# EAGLE schematic MKA DAC Test Board Schematic (EAGLE 9.6.2)

## Sheet 1 of 8
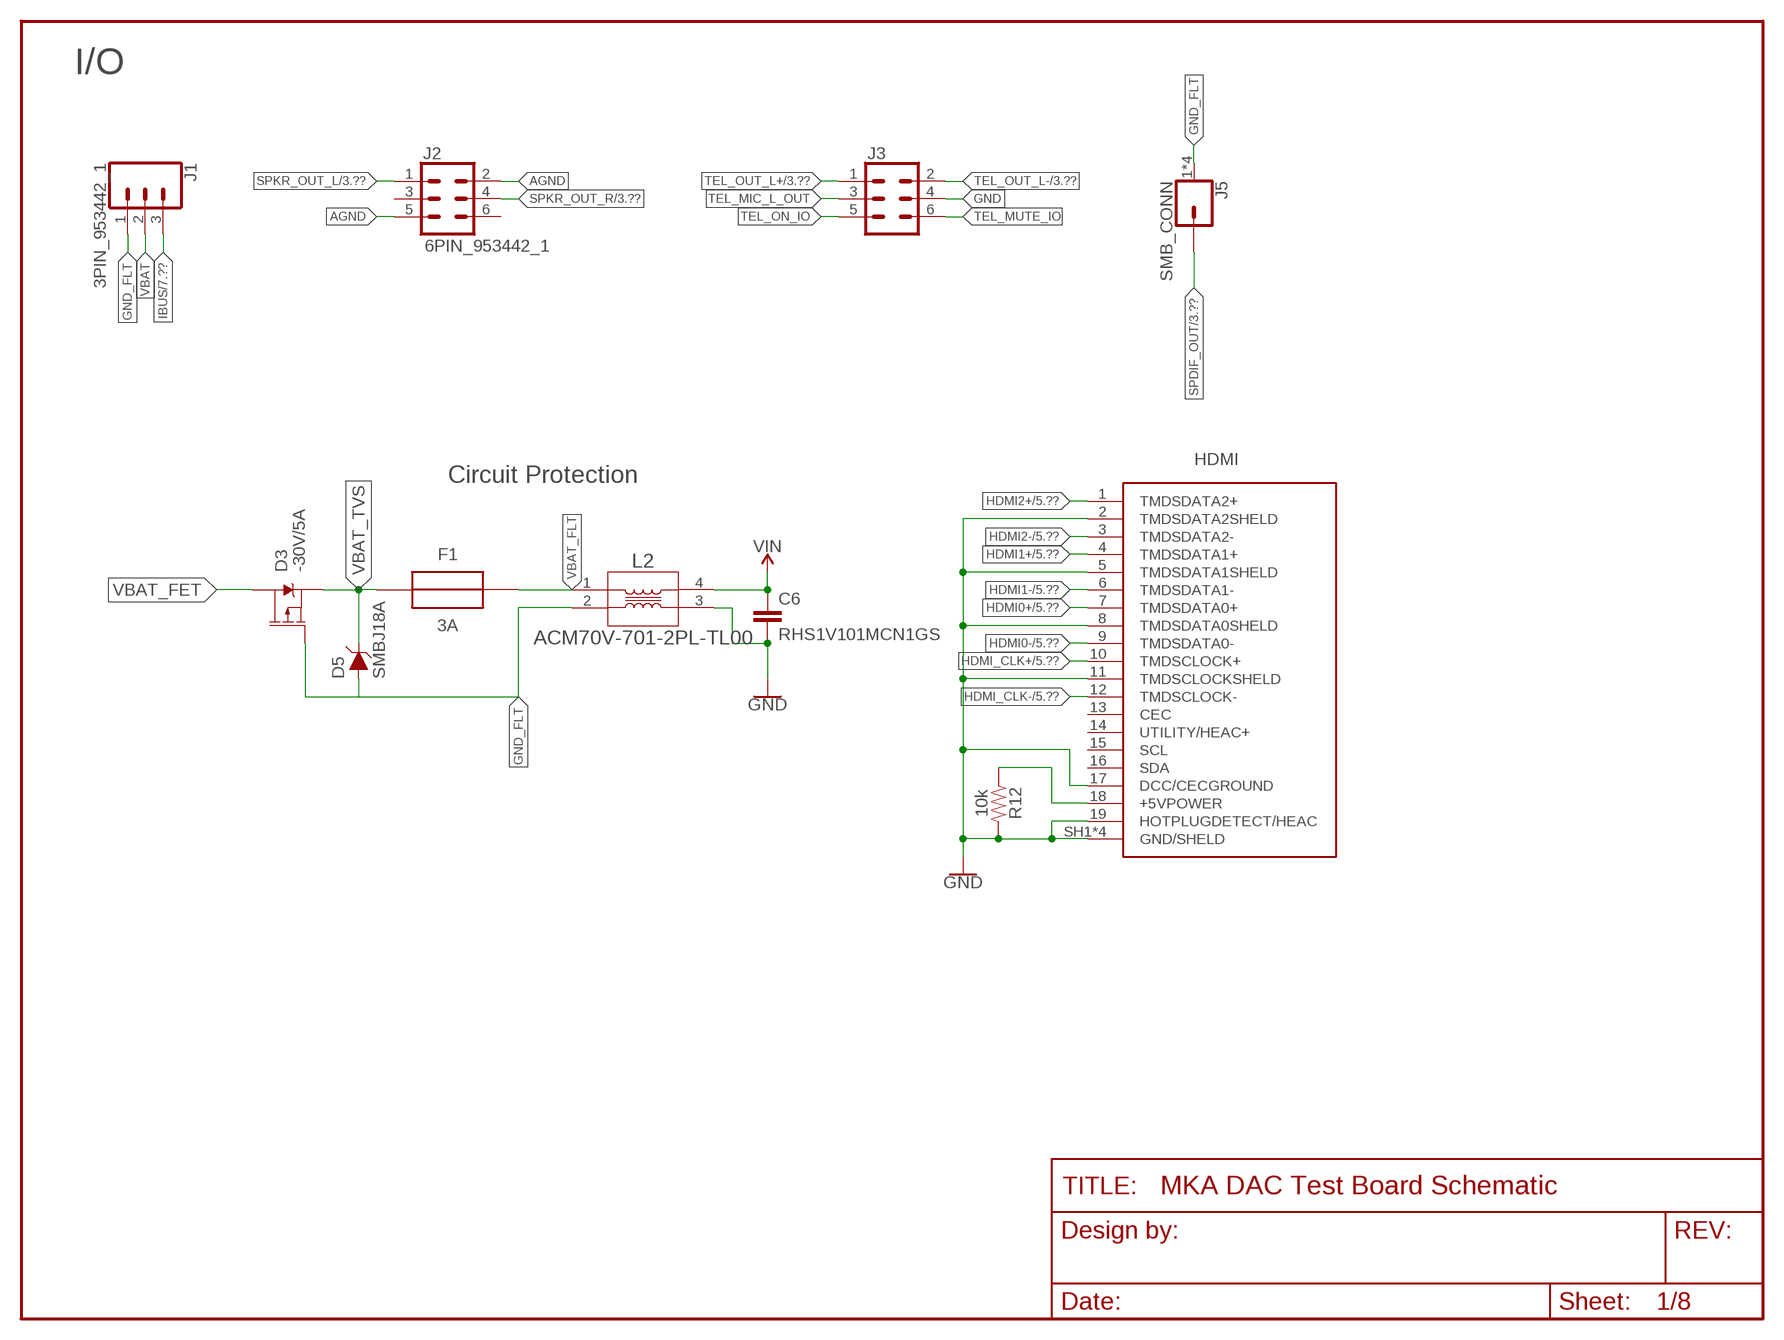
[diagram p0: schematic, sheet 1]

### Parts
C6  RHS1V101MCN1GS  [RHS1V101MCN1GS]
D3  -30V/5A  PMOSFET-SI2347DS  [SOT-23]
D5  SMBJ18A  [DO-214AA]
F1  3A  LITTLEBLOCK_FUSE_3A  [LITTLEFUSE]
FRAME3  FRAME-LETTER  [DUMMY]
J1  3PIN_953442_1  [TE_MQS_3PIN]
J2  6PIN_953442_1  [TE_MQS_6PIN]
J3  6PIN_5_103166_1  [TE_AMPMODU_6_PIN]
J5  SMB_CONN  [MOLEX_SMB]
L2  ACM70V-701-2PL-TL00  [ACM70V-701-2PL-TL00]
R12  10k  10KOHM0603  [0603]
U$2  HDMI_MOLEX_2086581051  [HDMI_MOLEX_2086581051]

### Nets
AGND: J2.2 J2.5 ; also sheet 3,6
GND: C6.2 J3.4 L2.3 R12.2 U$2.2(TMDSDATA2SHELD) U$2.5(TMDSDATA1SHELD) U$2.8(TMDSDATA0SHELD) U$2.11(TMDSCLOCKSHELD) U$2.17(DCC/CECGROUND) U$2.19(HOTPLUGDETECT/HEAC) U$2.SH1(GND/SHELD) U$2.SH2(GND/SHELD) U$2.SH3(GND/SHELD) U$2.SH4(GND/SHELD) ; also sheet 3,4,5,6,7
GND_FLT: D3.1(G) D5.A J1.1 J5.1(GND) J5.2(GND) J5.3(GND) J5.4(GND) L2.2
HDMI0+: U$2.7(TMDSDATA0+) ; also sheet 5
HDMI0-: U$2.9(TMDSDATA0-) ; also sheet 5
HDMI1+: U$2.4(TMDSDATA1+) ; also sheet 5
HDMI1-: U$2.6(TMDSDATA1-) ; also sheet 5
HDMI2+: U$2.1(TMDSDATA2+) ; also sheet 5
HDMI2-: U$2.3(TMDSDATA2-) ; also sheet 5
HDMI_CLK+: U$2.10(TMDSCLOCK+) ; also sheet 5
HDMI_CLK-: U$2.12(TMDSCLOCK-) ; also sheet 5
IBUS [Data]: J1.3 ; also sheet 7
N$16: R12.1 U$2.18(+5VPOWER)
SPDIF_OUT: J5.P$1 ; also sheet 3
SPKR_OUT_L: J2.1 ; also sheet 3
SPKR_OUT_R: J2.4 ; also sheet 3
TEL_MIC_L_OUT: J3.3
TEL_MUTE_IO: J3.6
TEL_ON_IO: J3.5
TEL_OUT_L+: J3.1 ; also sheet 3
TEL_OUT_L-: J3.2 ; also sheet 3
VBAT: J1.2
VBAT_FET: D3.3(D)
VBAT_FLT: F1.OUT(IN) L2.1
VBAT_TVS: D3.2(S) D5.C F1.IN(OUT)
VCC: C6.1 L2.4 ; supply symbol labelled VIN ; also sheet 4
Unconnected: J2.3 J2.6 U$2.13(CEC) U$2.14(UTILITY/HEAC+) U$2.15(SCL) U$2.16(SDA)

### Notes on the sheet
- I/O
- Circuit Protection

## Sheet 2 of 8
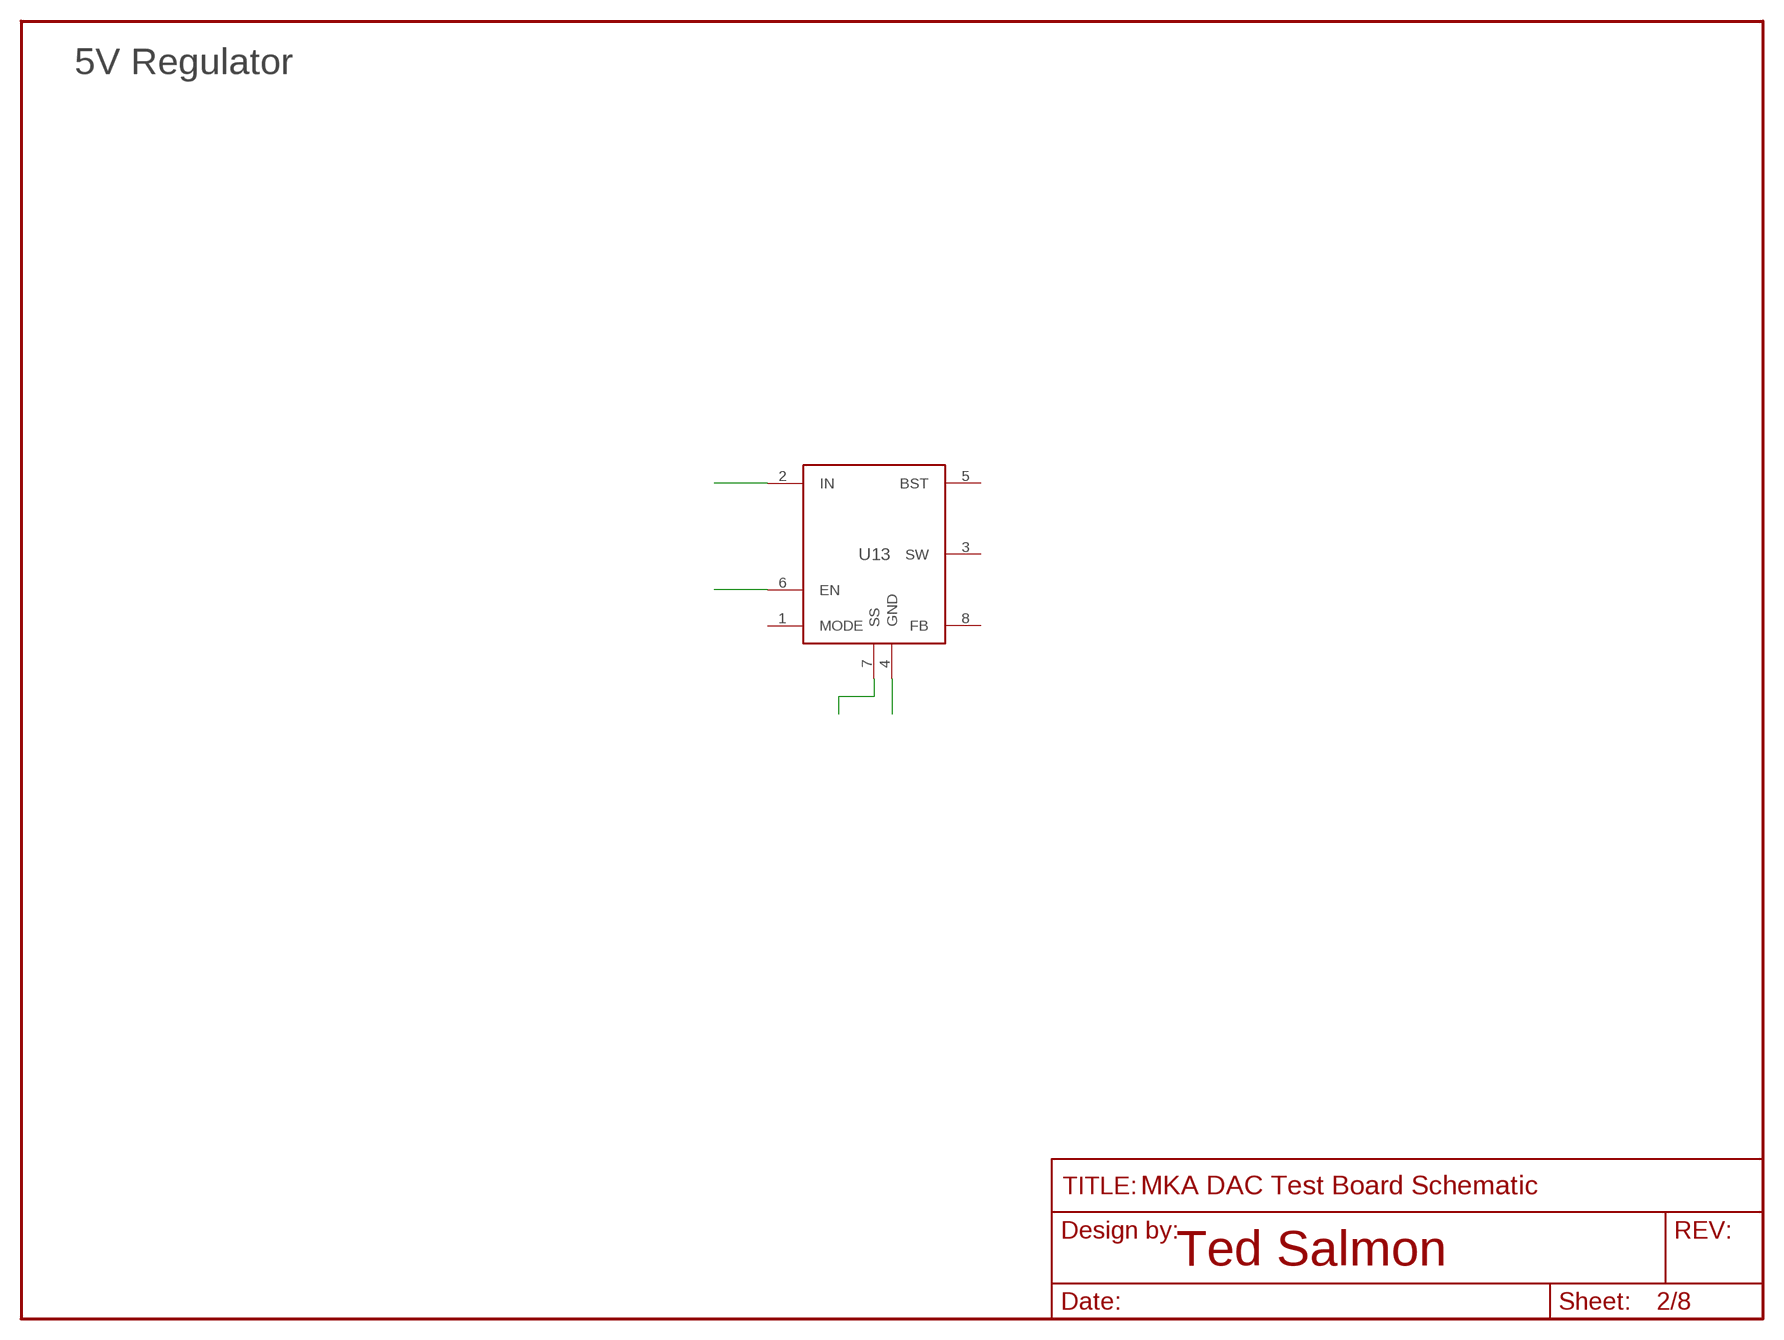
[diagram p1: schematic, sheet 2]

### Parts
FRAME1  FRAME-LETTER  [DUMMY]
U13  MP2348  [SOT583]

### Nets
N$1: U13.2(IN)
N$3: U13.6(EN)
N$4: U13.4(GND)
N$7: U13.7(SS)
Unconnected: U13.1(MODE) U13.3(SW) U13.5(BST) U13.8(FB)

### Notes on the sheet
- 5V Regulator
- Ted Salmon

## Sheet 3 of 8
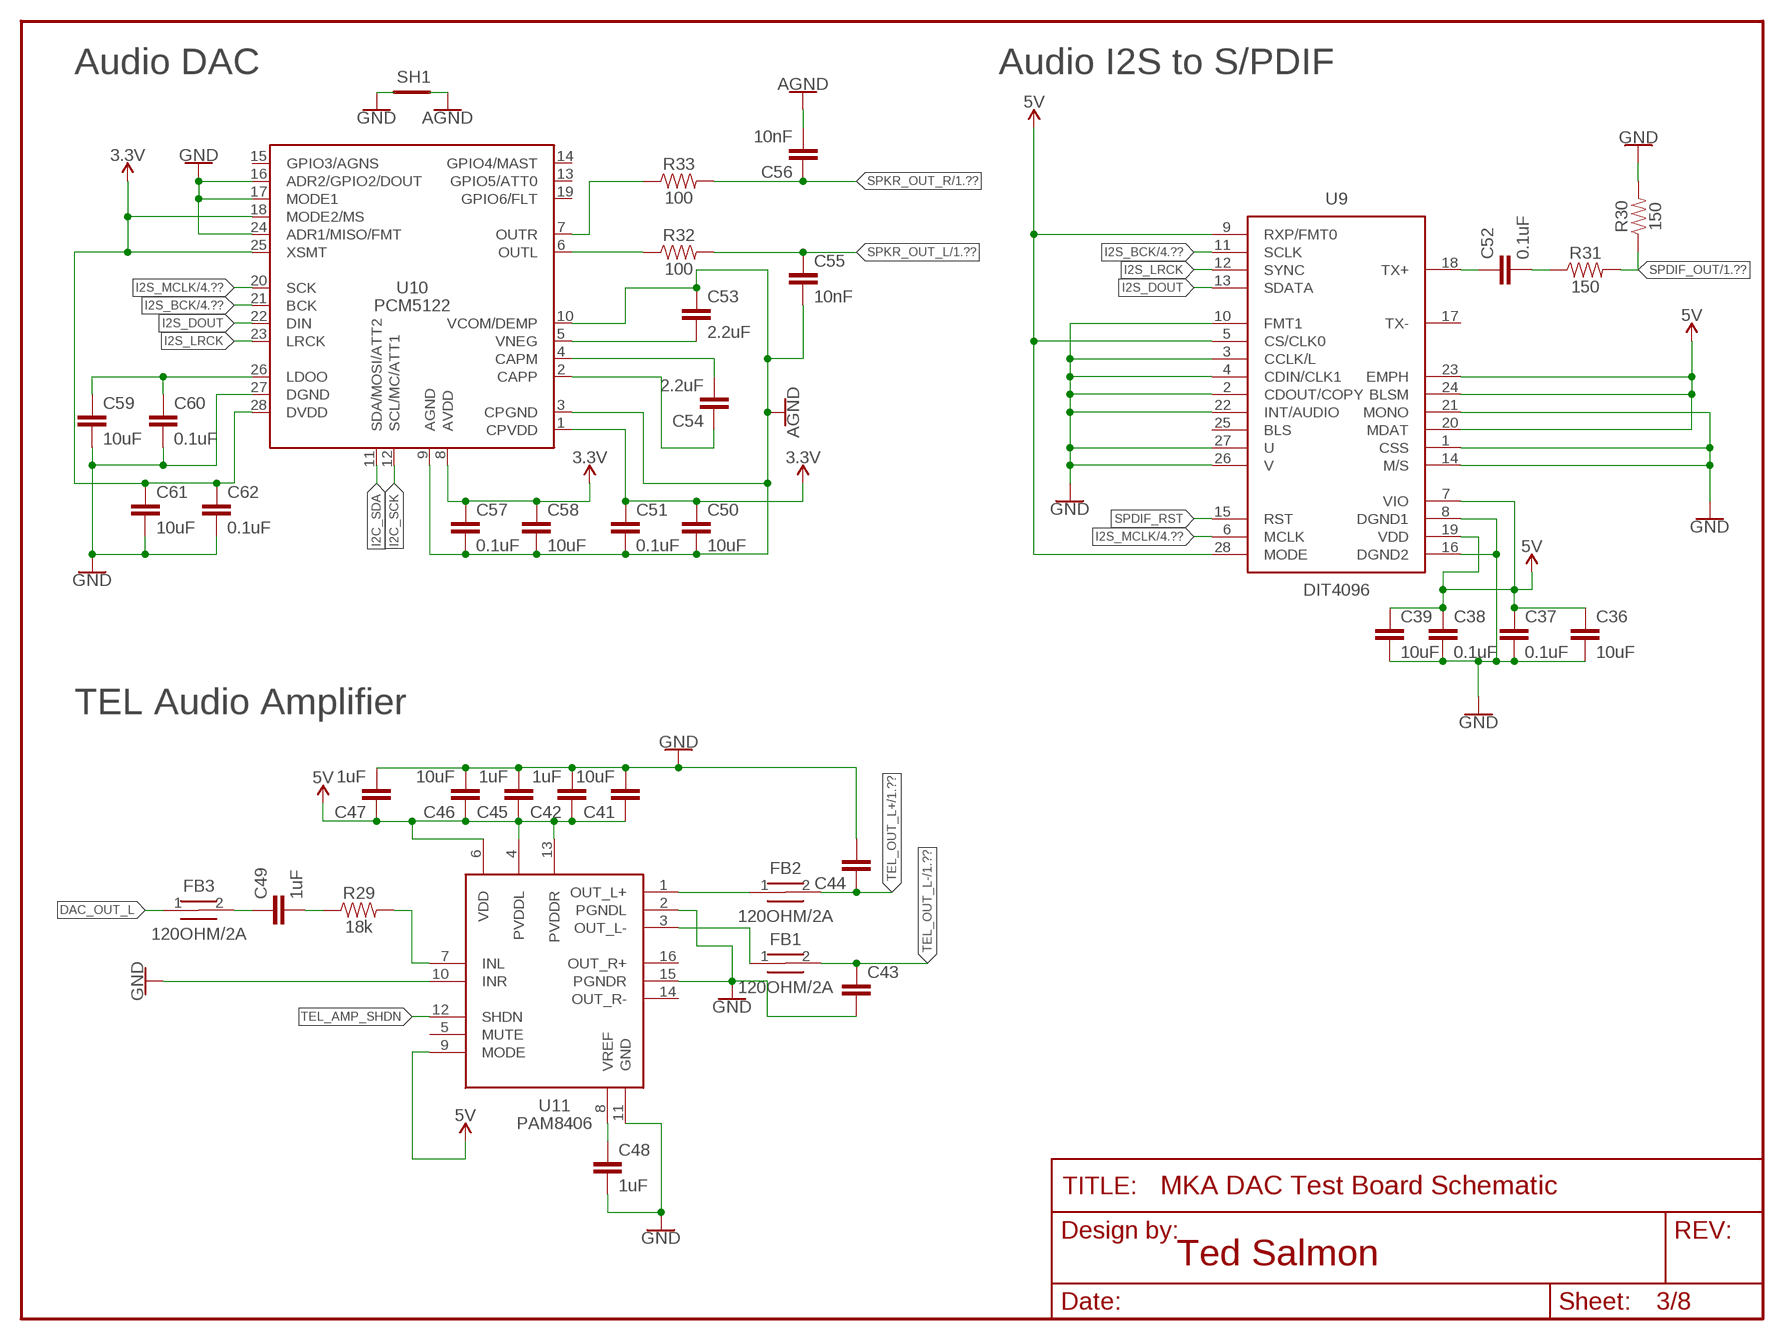
[diagram p2: schematic, sheet 3]

### Parts
C36  10uF  10UF0603  [0603]
C37  0.1uF  0.1UF0603  [0603]
C38  0.1uF  0.1UF0603  [0603]
C39  10uF  10UF0603  [0603]
C41  10uF  10UF0603  [0603]
C42  1uF  1UF0603  [0603]
C43  200pF  220PF0603  [0603]
C44  200pF  220PF0603  [0603]
C45  1uF  1UF0603  [0603]
C46  10uF  10UF0603  [0603]
C47  1uF  1UF0603  [0603]
C48  1uF  1UF0603  [0603]
C49  1uF  1UF0603  [0603]
C50  10uF  10UF0603  [0603]
C51  0.1uF  0.1UF0603  [0603]
C52  0.1uF  0.1UF0603  [0603]
C53  2.2uF  2.2UF0603  [0603]
C54  2.2uF  2.2UF0603  [0603]
C55  10nF  10NF0603  [0603]
C56  10nF  10NF0603  [0603]
C57  0.1uF  0.1UF0603  [0603]
C58  10uF  10UF0603  [0603]
C59  10uF  10UF0603  [0603]
C60  0.1uF  0.1UF0603  [0603]
C61  10uF  10UF0603  [0603]
C62  0.1uF  0.1UF0603  [0603]
FB1  120OHM/2A  FERRITE_2A/120OHM0603  [0603]
FB2  120OHM/2A  FERRITE_2A/120OHM0603  [0603]
FB3  120OHM/2A  FERRITE_2A/120OHM0603  [0603]
FRAME2  FRAME-LETTER  [DUMMY]
R29  18k  18KOHM0603  [0603]
R30  150  150OHM0603  [0603]
R31  150  150OHM0603  [0603]
R32  100  100OHM0603  [0603]
R33  100  100OHM0603  [0603]
SH1  SHORTT5  [SHORT_TOP-50]
U9  DIT4096  [TSSOP28]
U10  PCM5122  [TSSOP28]
U11  PAM8406  [SOP-16]

### Nets
3.3V [3.3V]: C50.1 C51.1 C57.1 C58.1 C61.1 C62.1 U10.1(CPVDD) U10.8(AVDD) U10.18(MODE2/MS) U10.25(XSMT) U10.28(DVDD) ; also sheet 4,6
5V [USB_5V]: C36.1 C37.1 C38.1 C39.1 C41.1 C42.1 C45.1 C46.1 C47.1 U9.5(CS/CLK0) U9.7(VIO) U9.9(RXP/FMT0) U9.19(VDD) U9.20(MDAT) U9.23(EMPH) U9.24(BLSM) U9.28(MODE) U11.4(PVDDL) U11.6(VDD) U11.9(MODE) U11.13(PVDDR)
AGND: C50.2 C51.2 C53.1 C55.2 C56.2 C57.2 C58.2 SH1.2 U10.3(CPGND) U10.9(AGND) U10.10(VCOM/DEMP) ; also sheet 1,6
DAC_CAPM: C54.2 U10.4(CAPM)
DAC_CAPP: C54.1 U10.2(CAPP)
DAC_LDOO: C59.1 C60.1 U10.26(LDOO)
DAC_OUT_L: FB3.1
DAC_OUT_L1: R32.1 U10.6(OUTL)
DAC_OUT_R: R33.1 U10.7(OUTR)
DAC_VNEG: C53.2 U10.5(VNEG)
GND: C36.2 C37.2 C38.2 C39.2 C41.2 C42.2 C43.2 C44.2 C45.2 C46.2 C47.2 C48.2 C59.2 C60.2 C61.2 C62.2 R30.2 SH1.1 U9.1(CSS) U9.2(CDOUT/COPY) U9.3(CCLK/L) U9.4(CDIN/CLK1) U9.8(DGND1) U9.10(FMT1) U9.14(M/S) U9.16(DGND2) U9.21(MONO) U9.22(INT/AUDIO) U9.26(V) U9.27(U) U10.16(ADR2/GPIO2/DOUT) U10.17(MODE1) U10.24(ADR1/MISO/FMT) U10.27(DGND) U11.2(PGNDL) U11.10(INR) U11.11(GND) U11.15(PGNDR) ; also sheet 1,4,5,6,7
I2C_SCK [MCU_Data]: U10.12(SCL/MC/ATT1)
I2C_SDA [MCU_Data]: U10.11(SDA/MOSI/ATT2)
I2S_BCK: U9.11(SCLK) U10.21(BCK) ; also sheet 4
I2S_DOUT: U9.13(SDATA) U10.22(DIN)
I2S_LRCK: U9.12(SYNC) U10.23(LRCK)
I2S_MCLK: U9.6(MCLK) U10.20(SCK) ; also sheet 4
SPDIF_OUT: R30.1 R31.2 ; also sheet 1
SPDIF_RST: U9.15(RST)
SPDIF_TX_FLT: C52.1 U9.18(TX+)
SPDIF_TX_RES: C52.2 R31.1
SPKR_OUT_L: C55.1 R32.2 ; also sheet 1
SPKR_OUT_R: C56.1 R33.2 ; also sheet 1
TEL_AMP_IN: C49.1 FB3.2
TEL_AMP_INL: R29.2 U11.7(INL)
TEL_AMP_INL_CAP_RES: C49.2 R29.1
TEL_AMP_OUT_L+: FB2.1 U11.1(OUT_L+)
TEL_AMP_OUT_L-: FB1.1 U11.3(OUT_L-)
TEL_AMP_SHDN [MCU_Data]: U11.12(SHDN)
TEL_AMP_VREF: C48.1 U11.8(VREF)
TEL_OUT_L+: C44.1 FB2.2 ; also sheet 1
TEL_OUT_L-: C43.1 FB1.2 ; also sheet 1
Unconnected: U9.17(TX-) U9.25(BLS) U10.13(GPIO5/ATT0) U10.14(GPIO4/MAST) U10.15(GPIO3/AGNS) U10.19(GPIO6/FLT) U11.5(MUTE) U11.14(OUT_R-) U11.16(OUT_R+)

### Notes on the sheet
- Audio DAC | Audio I2S to S/PDIF
- TEL Audio Amplifier
- Ted Salmon

## Sheet 4 of 8
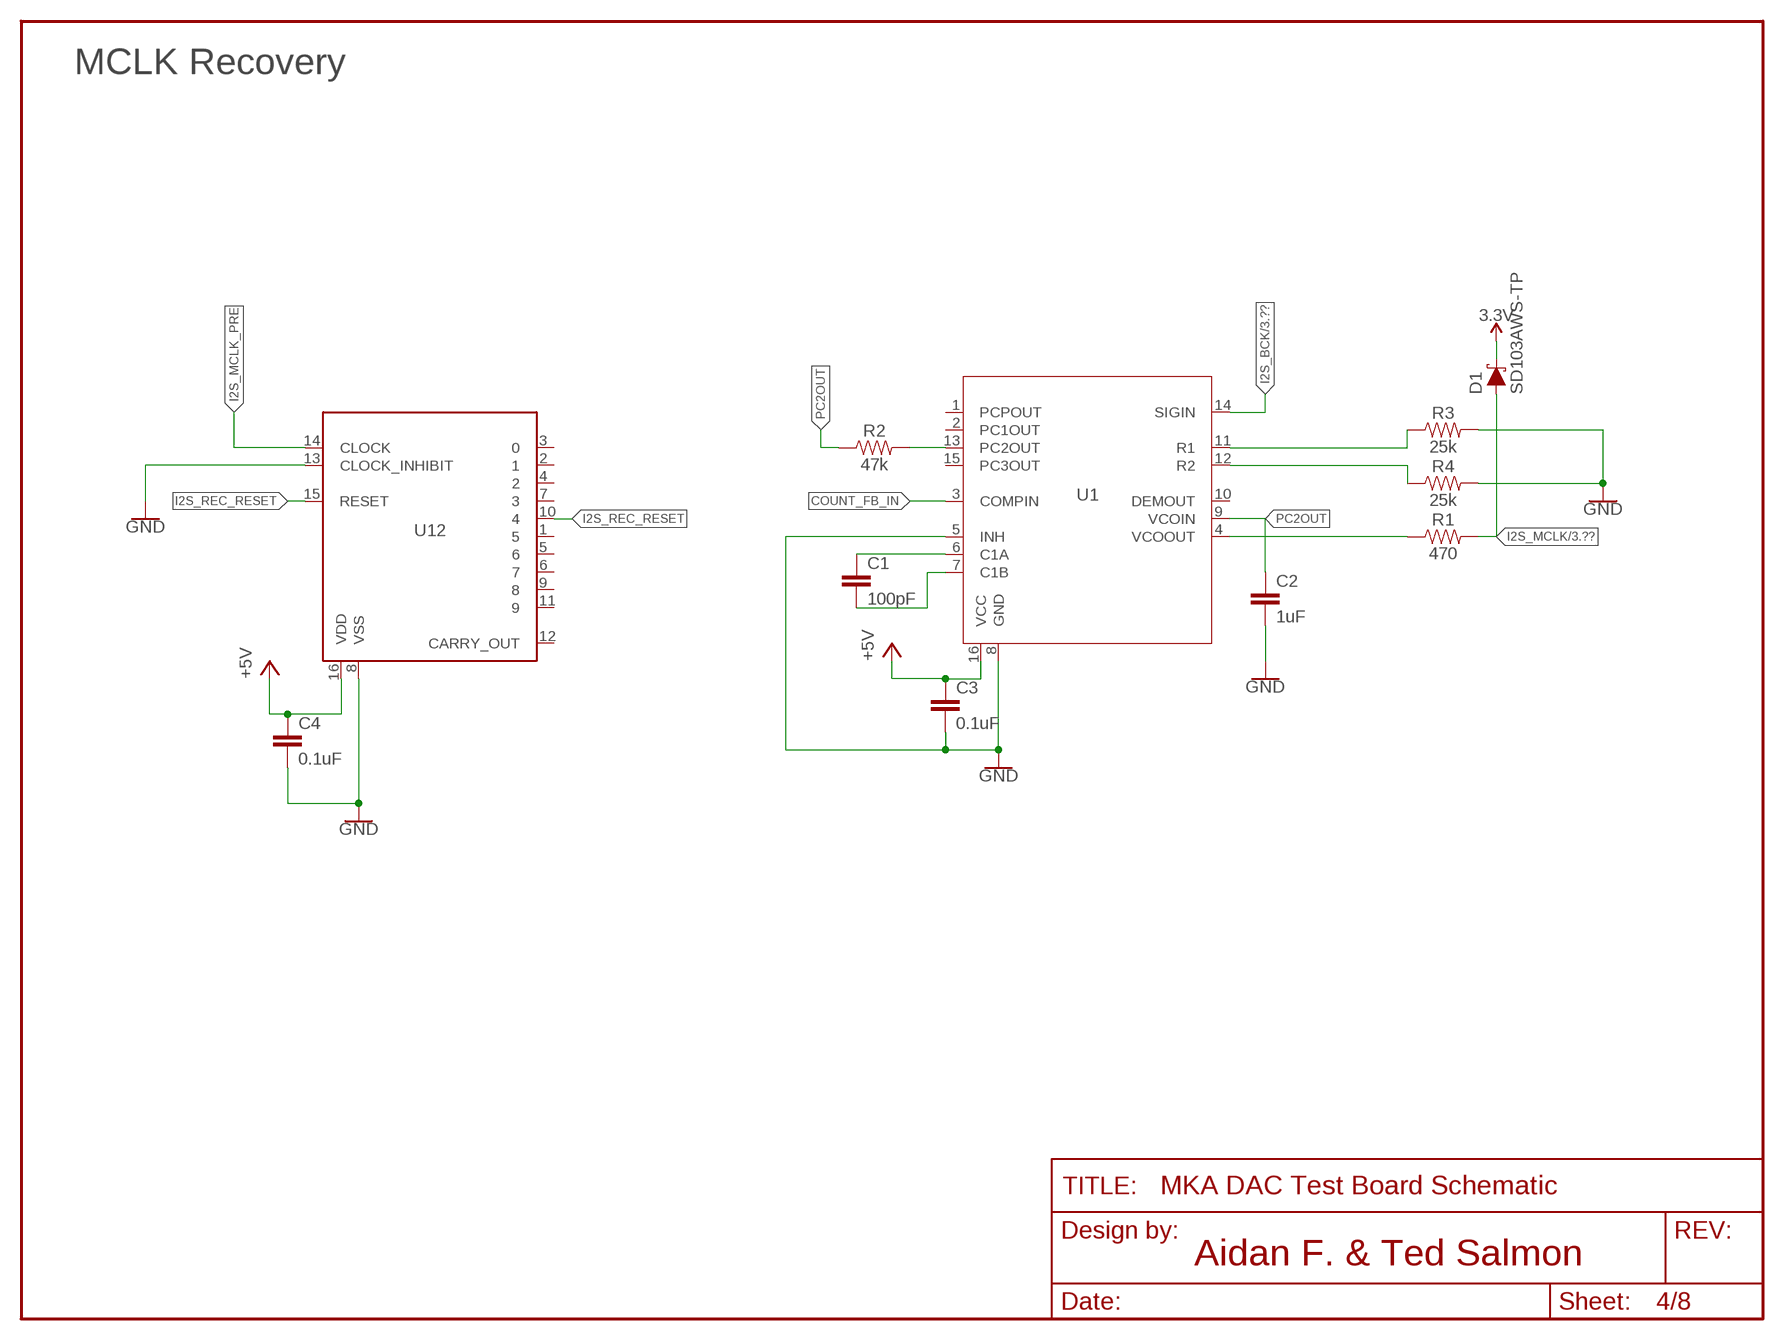
[diagram p3: schematic, sheet 4]

### Parts
C1  100pF  100PF0603  [0603]
C2  1uF  1UF  [0805]
C3  0.1uF  0.1UF0603  [0603]
C4  0.1uF  0.1UF0603  [0603]
D1  SD103AWS-TP  [SOD323]
FRAME7  FRAME-LETTER  [DUMMY]
R1  470  470OHM  [0805]
R2  47k  47KOHM  [0805]
R3  25k  25KOHM  [0805]
R4  25k  25KOHM  [0805]
U1  CD74HC4046A  [TSSOP16]
U12  74HC4017PW  [TSSOP16]

### Nets
3.3V [3.3V]: D1.C ; also sheet 3,6
COUNT_FB_IN: U1.3(COMPIN)
GND: C2.2 C3.2 C4.2 R3.2 R4.2 U1.5(INH) U1.8(GND) U12.8(VSS) U12.13(CLOCK_INHIBIT) ; also sheet 1,3,5,6,7
I2S_BCK: U1.14(SIGIN) ; also sheet 3
I2S_MCLK: D1.A R1.2 ; also sheet 3
I2S_MCLK_PRE: R1.1 U1.4(VCOOUT) U12.14(CLOCK)
I2S_REC_RESET: U12.10 U12.15(RESET)
N$5: C1.1 U1.6(C1A)
N$6: C1.2 U1.7(C1B)
PC2OUT: C2.1 R2.1 U1.9(VCOIN)
PC2OUT_RES: R2.2 U1.13(PC2OUT)
R1: R3.1 U1.11(R1)
R2: R4.1 U1.12(R2)
VCC: C3.1 C4.1 U1.16(VCC) U12.16(VDD) ; supply symbol labelled +5V ; also sheet 1
Unconnected: U1.1(PCPOUT) U1.2(PC1OUT) U1.10(DEMOUT) U1.15(PC3OUT) U12.1 U12.2 U12.3 U12.4 U12.5 U12.6 U12.7 U12.9 U12.11 U12.12(CARRY_OUT)

### Notes on the sheet
- MCLK Recovery
- Aidan F. & Ted Salmon

## Sheet 5 of 8
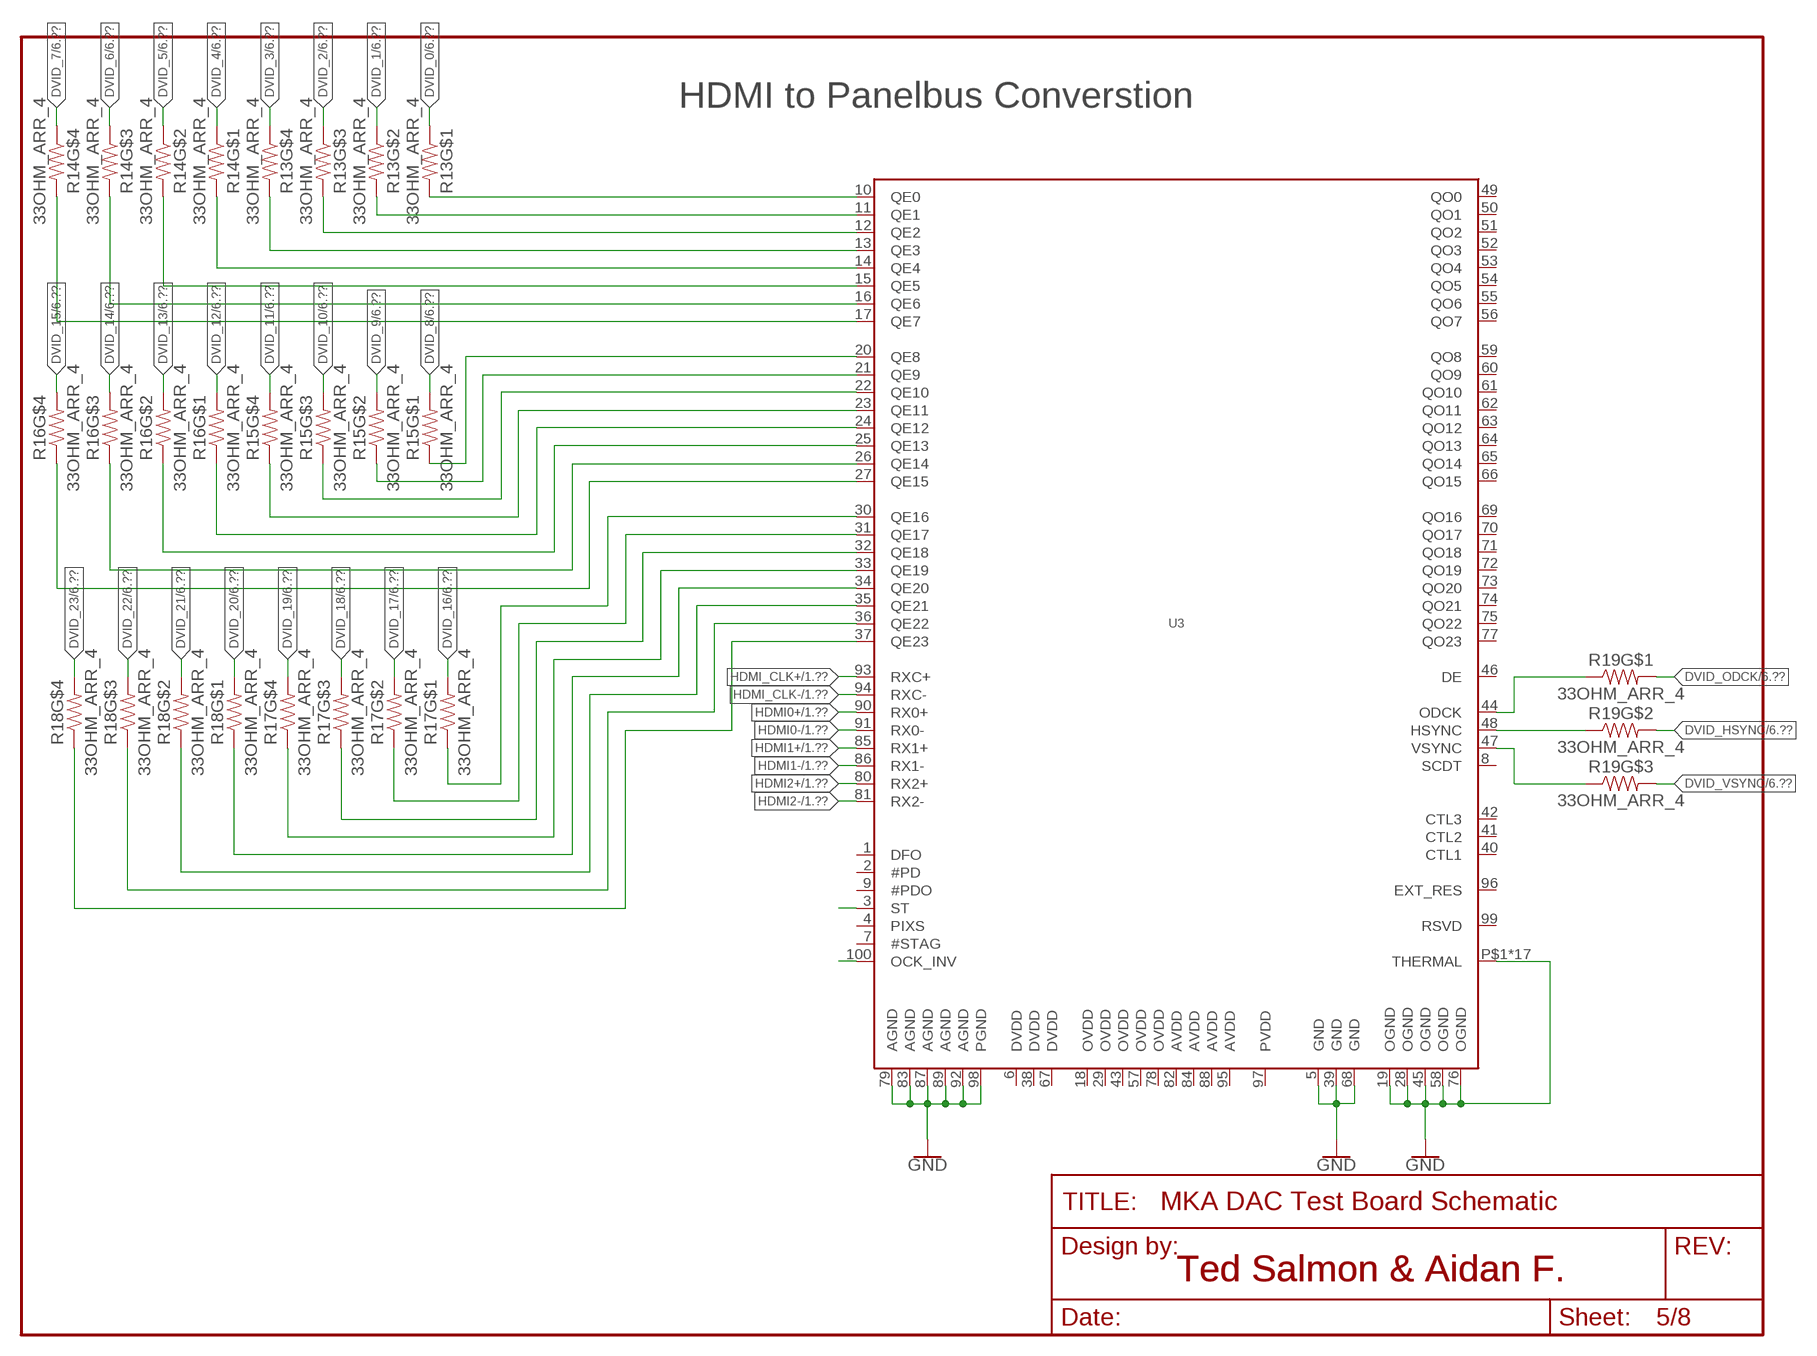
[diagram p4: schematic, sheet 5]

### Parts
FRAME5  FRAME-LETTER  [DUMMY]
R13  33OHM_ARR_4  [RES_ARRAY_4]
R14  33OHM_ARR_4  [RES_ARRAY_4]
R15  33OHM_ARR_4  [RES_ARRAY_4]
R16  33OHM_ARR_4  [RES_ARRAY_4]
R17  33OHM_ARR_4  [RES_ARRAY_4]
R18  33OHM_ARR_4  [RES_ARRAY_4]
R19  33OHM_ARR_4  [RES_ARRAY_4]
U3  TFP401  [S-PQFP-G100]

### Nets
DVID_0: R13.1 ; also sheet 6
DVID_0_RES: R13.8 U3.10(QE0)
DVID_1: R13.2 ; also sheet 6
DVID_1_RES: R13.7 U3.11(QE1)
DVID_2: R13.3 ; also sheet 6
DVID_2_RES: R13.6 U3.12(QE2)
DVID_3: R13.4 ; also sheet 6
DVID_3_RES: R13.5 U3.13(QE3)
DVID_4: R14.1 ; also sheet 6
DVID_4_RES: R14.8 U3.14(QE4)
DVID_5: R14.2 ; also sheet 6
DVID_5_RES: R14.7 U3.15(QE5)
DVID_6: R14.3 ; also sheet 6
DVID_6_RES: R14.6 U3.16(QE6)
DVID_7: R14.4 ; also sheet 6
DVID_7_RES: R14.5 U3.17(QE7)
DVID_8: R15.8 ; also sheet 6
DVID_8_RES: R15.1 U3.20(QE8)
DVID_9: R15.7 ; also sheet 6
DVID_9_RES: R15.2 U3.21(QE9)
DVID_10: R15.6 ; also sheet 6
DVID_10_RES: R15.3 U3.22(QE10)
DVID_11: R15.5 ; also sheet 6
DVID_11_RES: R15.4 U3.23(QE11)
DVID_12: R16.8 ; also sheet 6
DVID_12_RES: R16.1 U3.24(QE12)
DVID_13: R16.7 ; also sheet 6
DVID_13_RES: R16.2 U3.25(QE13)
DVID_14: R16.6 ; also sheet 6
DVID_14_RES: R16.3 U3.26(QE14)
DVID_15: R16.5 ; also sheet 6
DVID_15_RES: R16.4 U3.27(QE15)
DVID_16: R17.8 ; also sheet 6
DVID_16_RES: R17.1 U3.30(QE16)
DVID_17: R17.7 ; also sheet 6
DVID_17_RES: R17.2 U3.31(QE17)
DVID_18: R17.6 ; also sheet 6
DVID_18_RES: R17.3 U3.32(QE18)
DVID_19: R17.5 ; also sheet 6
DVID_19_RES: R17.4 U3.33(QE19)
DVID_20: R18.8 ; also sheet 6
DVID_20_RES: R18.1 U3.34(QE20)
DVID_21: R18.7 ; also sheet 6
DVID_21_RES: R18.2 U3.35(QE21)
DVID_22: R18.6 ; also sheet 6
DVID_22_RES: R18.3 U3.36(QE22)
DVID_23: R18.5 ; also sheet 6
DVID_23_RFS: R18.4 U3.37(QE23)
DVID_HSYNC: R19.7 ; also sheet 6
DVID_HSYNC_RES: R19.2 U3.48(HSYNC)
DVID_ODCK: R19.8 ; also sheet 6
DVID_ODCK_RES: R19.1 U3.44(ODCK)
DVID_VSYNC: R19.6 ; also sheet 6
DVID_VSYNC_RES: R19.3 U3.47(VSYNC)
GND: U3.5(GND) U3.19(OGND) U3.28(OGND) U3.39(GND) U3.45(OGND) U3.58(OGND) U3.68(GND) U3.76(OGND) U3.79(AGND) U3.83(AGND) U3.87(AGND) U3.89(AGND) U3.92(AGND) U3.98(PGND) U3.P$1(THERMAL) U3.P$2(THERMAL) U3.P$3(THERMAL) U3.P$4(THERMAL) U3.P$5(THERMAL) U3.P$6(THERMAL) U3.P$7(THERMAL) U3.P$8(THERMAL) U3.P$9(THERMAL) U3.P$10(THERMAL) U3.P$11(THERMAL) U3.P$12(THERMAL) U3.P$13(THERMAL) U3.P$14(THERMAL) U3.P$15(THERMAL) U3.P$16(THERMAL) U3.THERM(THERMAL) ; also sheet 1,3,4,6,7
HDMI0+: U3.90(RX0+) ; also sheet 1
HDMI0-: U3.91(RX0-) ; also sheet 1
HDMI1+: U3.85(RX1+) ; also sheet 1
HDMI1-: U3.86(RX1-) ; also sheet 1
HDMI2+: U3.80(RX2+) ; also sheet 1
HDMI2-: U3.81(RX2-) ; also sheet 1
HDMI_CLK+: U3.93(RXC+) ; also sheet 1
HDMI_CLK-: U3.94(RXC-) ; also sheet 1
N$15: U3.3(ST)
N$23: U3.100(OCK_INV)
Unconnected: R19.4 R19.5 U3.1(DFO) U3.2(#PD) U3.4(PIXS) U3.7(#STAG) U3.8(SCDT) U3.9(#PDO) U3.40(CTL1) U3.41(CTL2) U3.42(CTL3) U3.46(DE) U3.49(QO0) U3.50(QO1) U3.51(QO2) U3.52(QO3) U3.53(QO4) U3.54(QO5) U3.55(QO6) U3.56(QO7) U3.59(QO8) U3.60(QO9) U3.61(QO10) U3.62(QO11) U3.63(QO12) U3.64(QO13) U3.65(QO14) U3.66(QO15) U3.69(QO16) U3.70(QO17) U3.71(QO18) U3.72(QO19) U3.73(QO20) U3.74(QO21) U3.75(QO22) U3.77(QO23) U3.96(EXT_RES) U3.99(RSVD)

### Notes on the sheet
- HDMI to Panelbus Converstion
- Ted Salmon & Aidan F. | Ted Salmon & Aidan F.

## Sheet 6 of 8
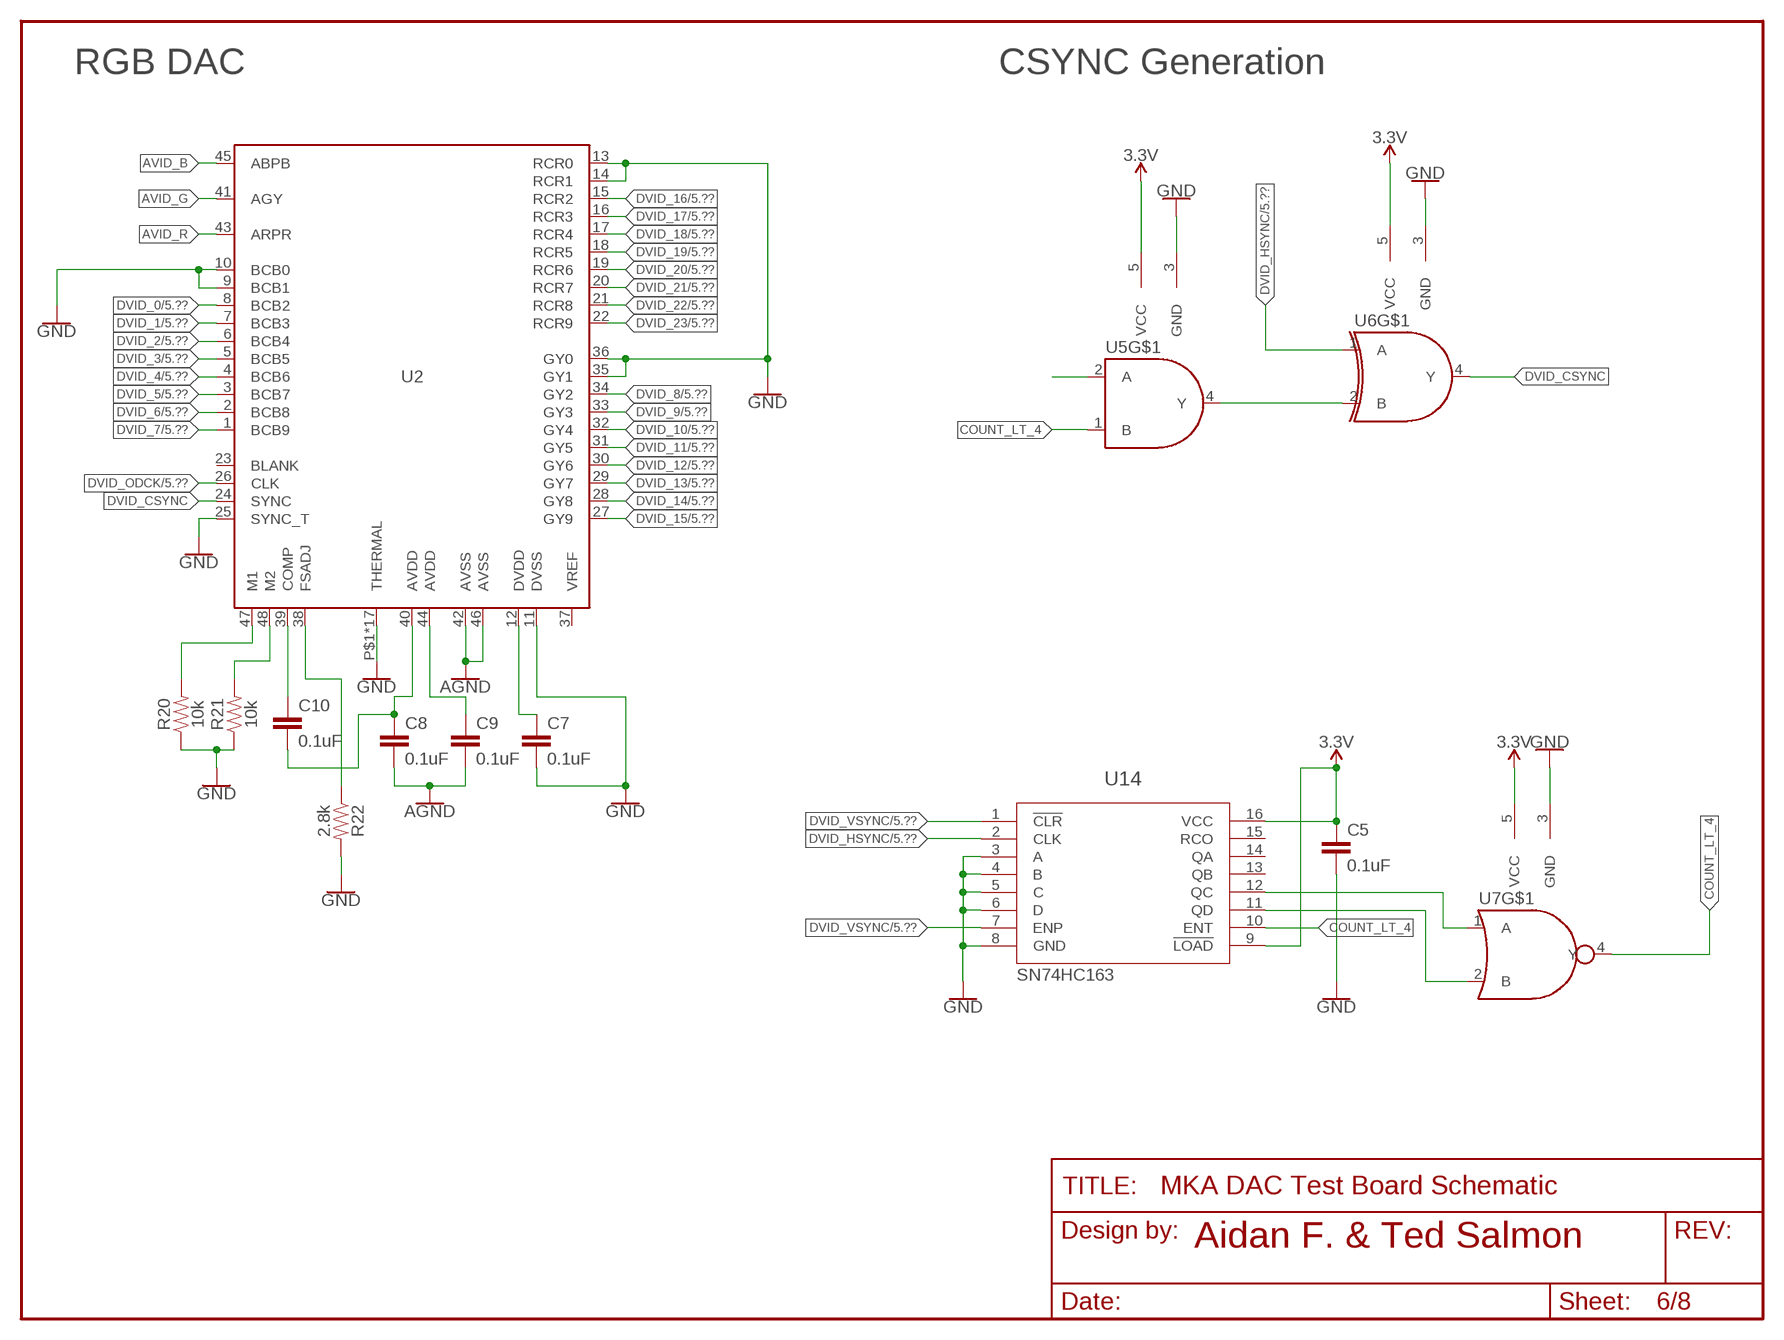
[diagram p5: schematic, sheet 6]

### Parts
C5  0.1uF  0.1UF0603  [0603]
C7  0.1uF  0.1UF0603  [0603]
C8  0.1uF  0.1UF0603  [0603]
C9  0.1uF  0.1UF0603  [0603]
C10  0.1uF  0.1UF0603  [0603]
FRAME4  FRAME-LETTER  [DUMMY]
R20  10k  10KOHM0603  [0603]
R21  10k  10KOHM0603  [0603]
R22  2.8k  2.8KOHM0603  [0603]
U2  THS8135  [S-PQFP-G48]
U5  74LVC1G08  [SOT353-1]
U6  74VC1G86Q  [SOT353-1]
U7  SN74AHC1G02DCK  [SOT353-1]
U14  SN74HC163  [TSSOP16]

### Nets
3.3V [3.3V]: C5.1 U5.5(VCC) U6.5(VCC) U7.5(VCC) U14.9(!LOAD) U14.16(VCC) ; also sheet 3,4
AGND: C8.2 C9.2 U2.42(AVSS) U2.46(AVSS) ; also sheet 1,3
AVID_B: U2.45(ABPB)
AVID_FSADJ: R22.1 U2.38(FSADJ)
AVID_G: U2.41(AGY)
AVID_M1_RES: R20.2 U2.47(M1)
AVID_M2_RES: R21.2 U2.48(M2)
AVID_R: U2.43(ARPR)
COUNT_LT_4: U5.1(B) U7.4(Y) U14.10(ENT)
COUNTER_QC: U7.1(A) U14.12(QC)
COUNTER_QD: U7.2(B) U14.11(QD)
DVID_0: U2.8(BCB2) ; also sheet 5
DVID_1: U2.7(BCB3) ; also sheet 5
DVID_2: U2.6(BCB4) ; also sheet 5
DVID_3: U2.5(BCB5) ; also sheet 5
DVID_4: U2.4(BCB6) ; also sheet 5
DVID_5: U2.3(BCB7) ; also sheet 5
DVID_6: U2.2(BCB8) ; also sheet 5
DVID_7: U2.1(BCB9) ; also sheet 5
DVID_8: U2.34(GY2) ; also sheet 5
DVID_9: U2.33(GY3) ; also sheet 5
DVID_10: U2.32(GY4) ; also sheet 5
DVID_11: U2.31(GY5) ; also sheet 5
DVID_12: U2.30(GY6) ; also sheet 5
DVID_13: U2.29(GY7) ; also sheet 5
DVID_14: U2.28(GY8) ; also sheet 5
DVID_15: U2.27(GY9) ; also sheet 5
DVID_16: U2.15(RCR2) ; also sheet 5
DVID_17: U2.16(RCR3) ; also sheet 5
DVID_18: U2.17(RCR4) ; also sheet 5
DVID_19: U2.18(RCR5) ; also sheet 5
DVID_20: U2.19(RCR6) ; also sheet 5
DVID_21: U2.20(RCR7) ; also sheet 5
DVID_22: U2.21(RCR8) ; also sheet 5
DVID_23: U2.22(RCR9) ; also sheet 5
DVID_CSYNC: U2.24(SYNC) U6.4(Y)
DVID_HSYNC: U6.1(A) U14.2(CLK) ; also sheet 5
DVID_ODCK: U2.26(CLK) ; also sheet 5
DVID_VSYNC: U5.2(A) U14.1(!CLR) U14.7(ENP) ; also sheet 5
GND: C5.2 C7.2 R20.1 R21.1 R22.2 U2.9(BCB1) U2.10(BCB0) U2.11(DVSS) U2.13(RCR0) U2.14(RCR1) U2.25(SYNC_T) U2.35(GY1) U2.36(GY0) U2.P$1(THERMAL) U2.P$2(THERMAL) U2.P$3(THERMAL) U2.P$4(THERMAL) U2.P$5(THERMAL) U2.P$6(THERMAL) U2.P$7(THERMAL) U2.P$8(THERMAL) U2.P$9(THERMAL) U2.P$10(THERMAL) U2.P$11(THERMAL) U2.P$12(THERMAL) U2.P$13(THERMAL) U2.P$14(THERMAL) U2.P$15(THERMAL) U2.P$16(THERMAL) U2.THERM(THERMAL) U5.3(GND) U6.3(GND) U7.3(GND) U14.3(A) U14.4(B) U14.5(C) U14.6(D) U14.8(GND) ; also sheet 1,3,4,5,7
N$2: U5.4(Y) U6.2(B)
N$24: C10.1 U2.39(COMP)
N$28: C8.1 C10.2 U2.40(AVDD)
N$29: C9.1 U2.44(AVDD)
N$32: C7.1 U2.12(DVDD)
Unconnected: U2.23(BLANK) U2.37(VREF) U14.13(QB) U14.14(QA) U14.15(RCO)

### Notes on the sheet
- RGB DAC | CSYNC Generation
- Aidan F. & Ted Salmon

## Sheet 7 of 8
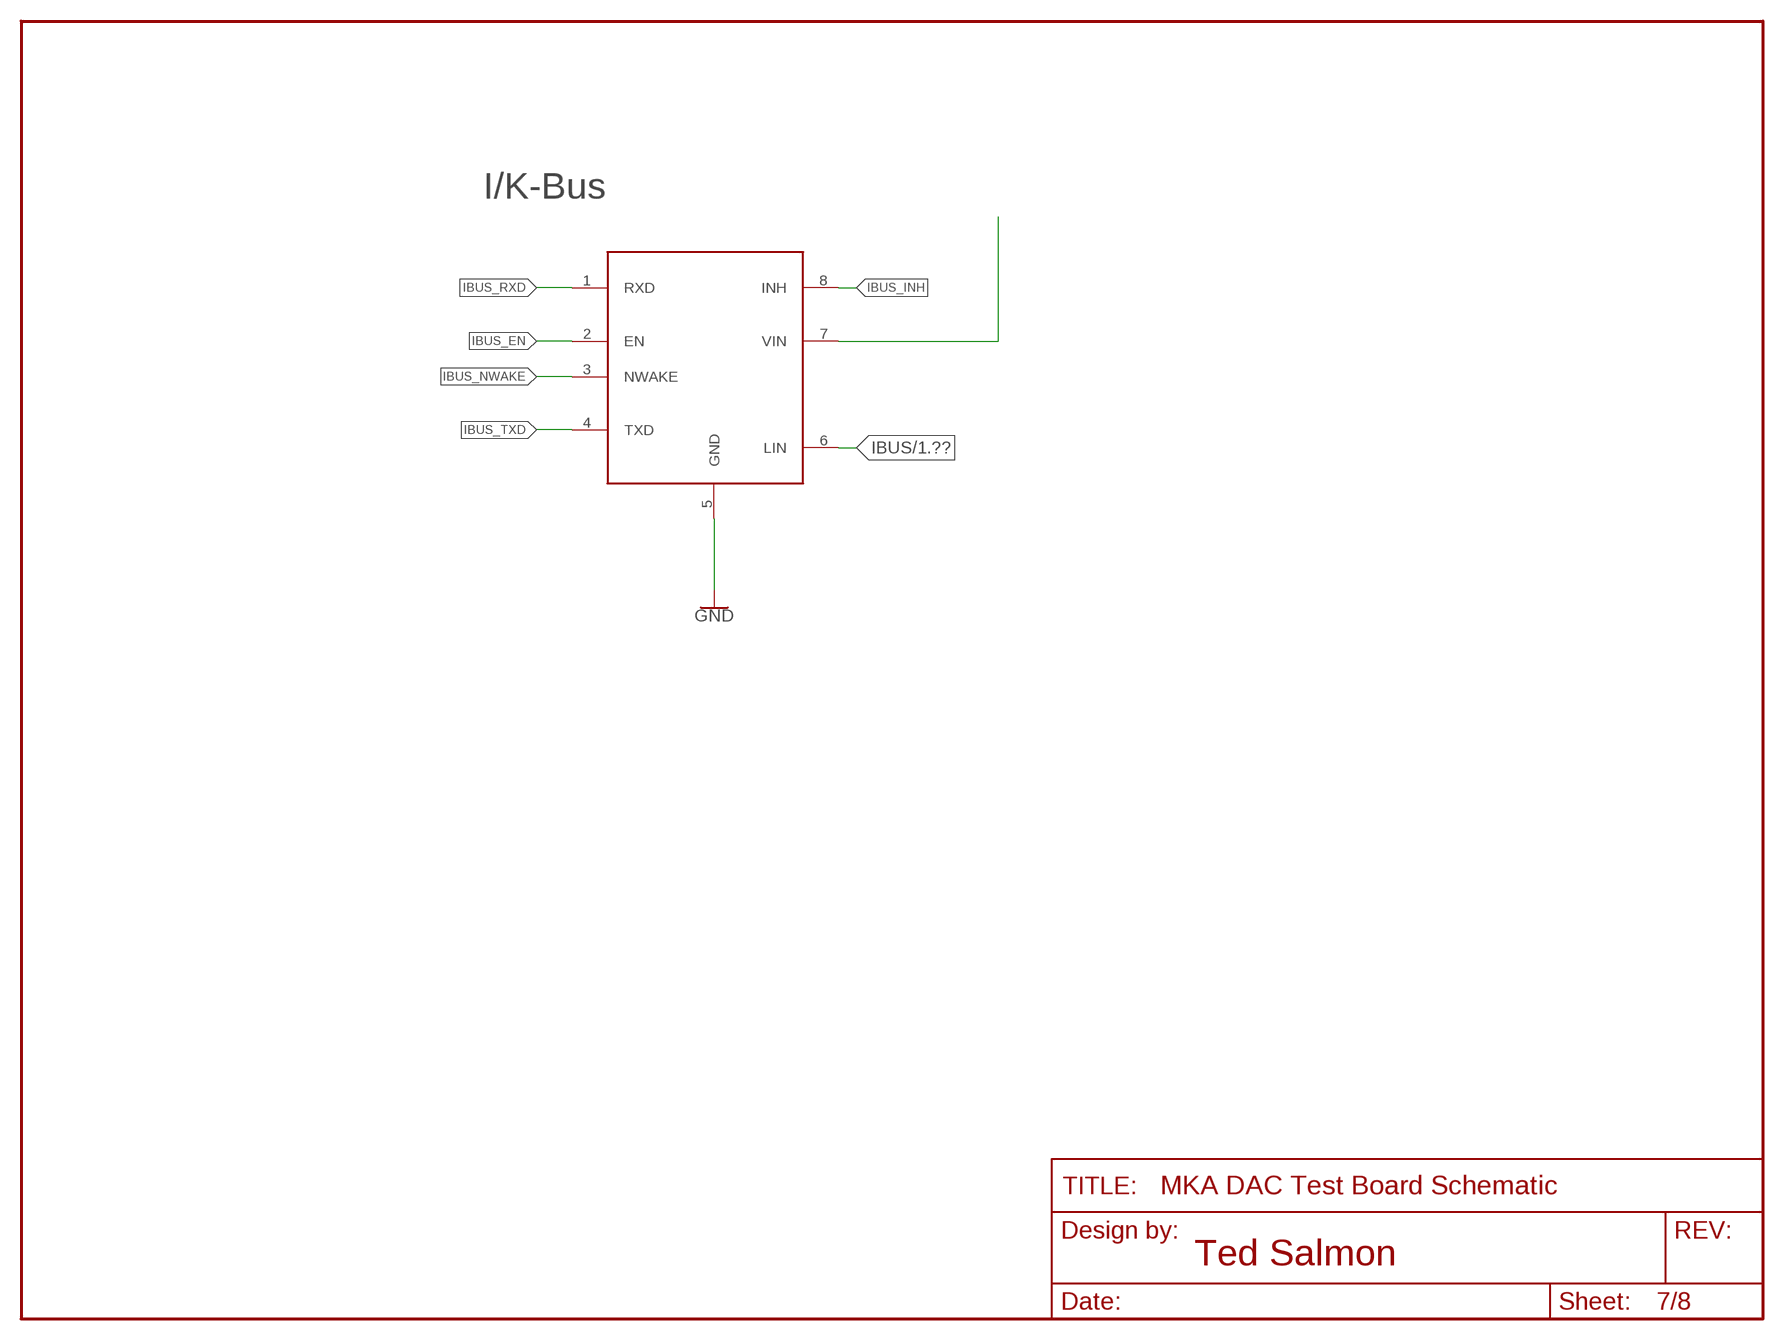
[diagram p6: schematic, sheet 7]

### Parts
FRAME6  FRAME-LETTER  [DUMMY]
U4  SN65HVDA100  [SOIC-8]

### Nets
GND: U4.5(GND) ; also sheet 1,3,4,5,6
IBUS [Data]: U4.6(LIN) ; also sheet 1
IBUS_EN: U4.2(EN)
IBUS_INH: U4.8(INH)
IBUS_NWAKE: U4.3(NWAKE)
IBUS_RXD: U4.1(RXD)
IBUS_TXD: U4.4(TXD)
N$10: U4.7(VIN)

### Notes on the sheet
- I/K-Bus
- Ted Salmon

## Sheet 8 of 8
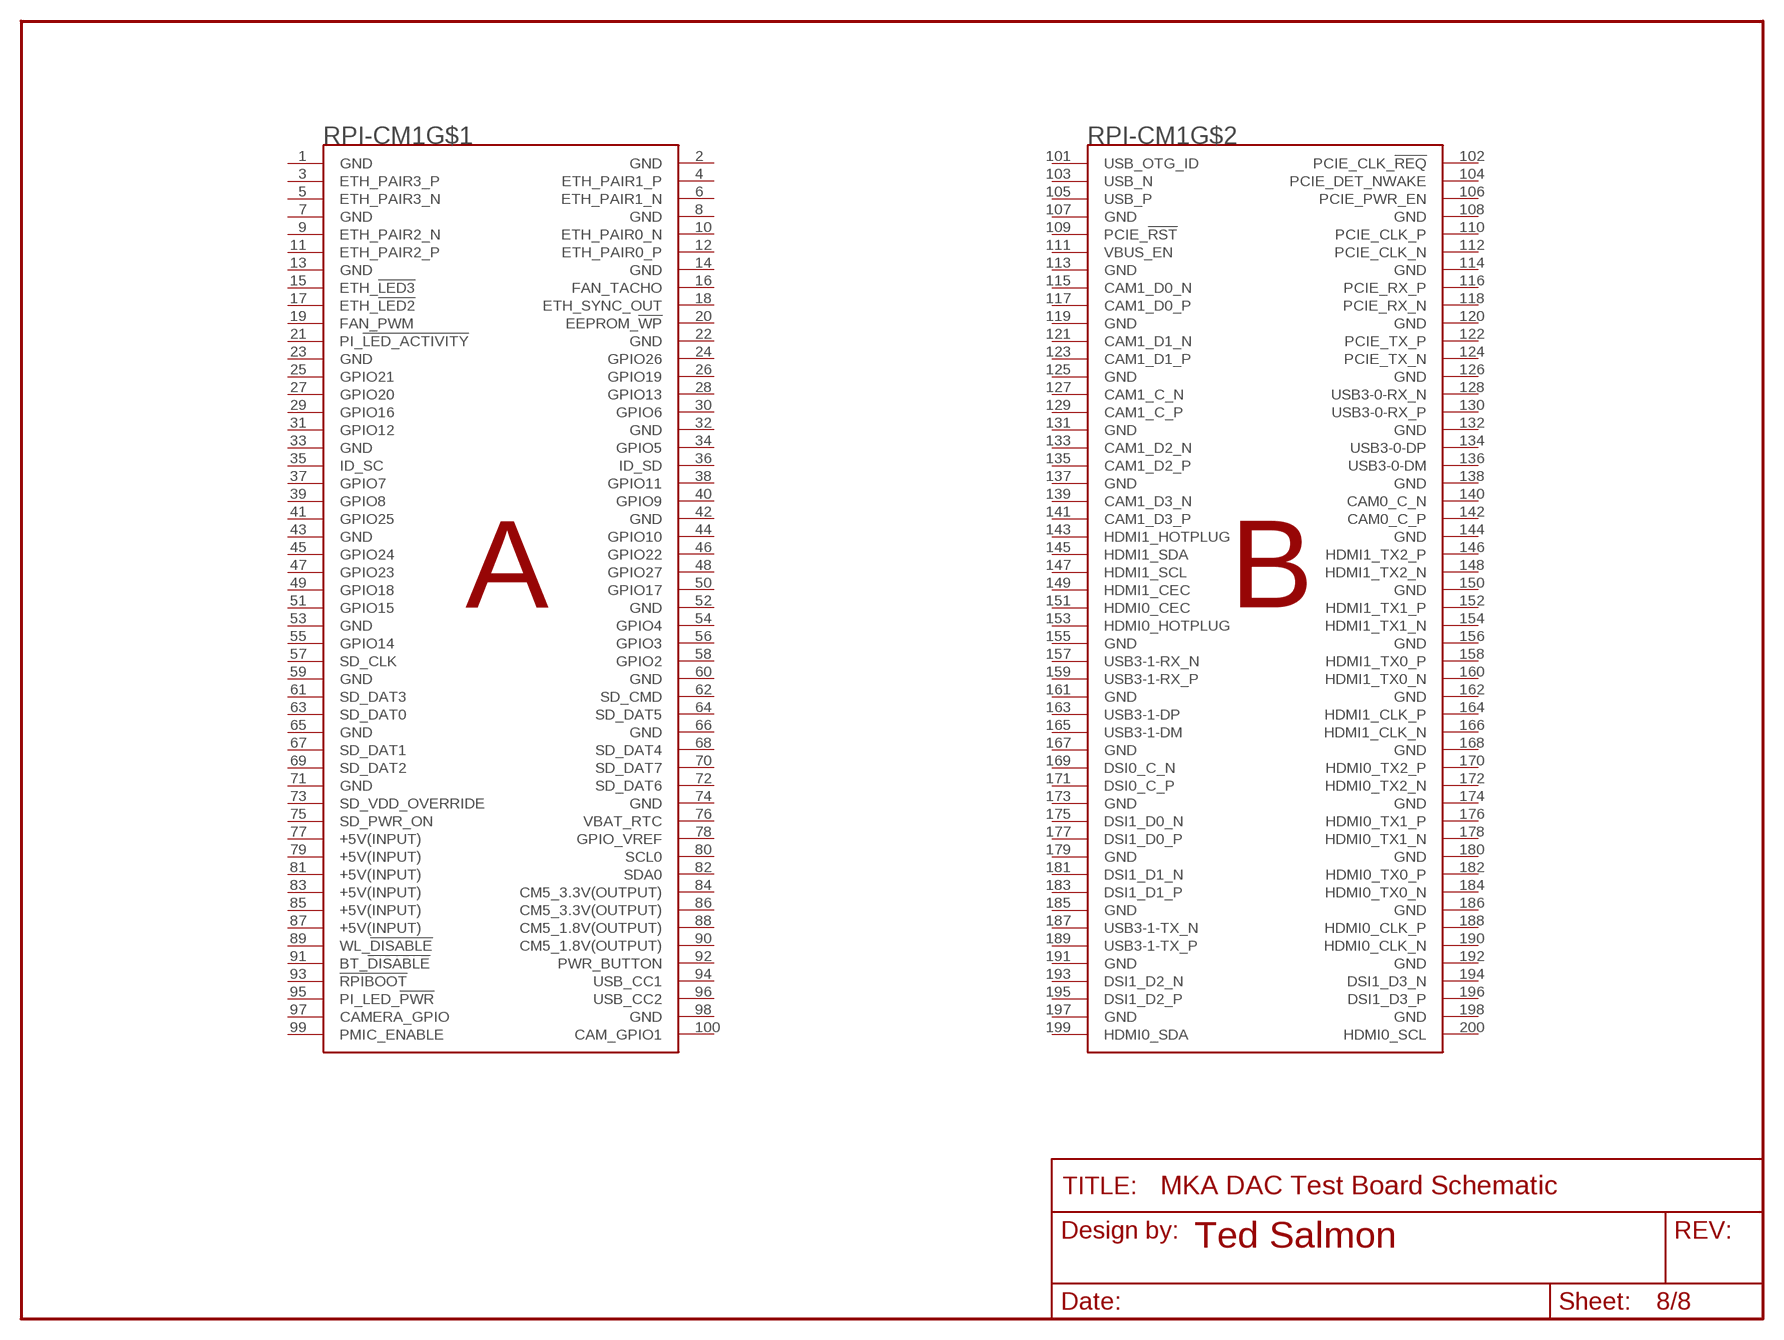
[diagram p7: schematic, sheet 8]

### Parts
FRAME8  FRAME-LETTER  [DUMMY]
RPI-CM1  RPI-CM5  [RPI-CM5]
Unconnected: RPI-CM1.1(GND) RPI-CM1.2(GND) RPI-CM1.3(ETH_PAIR3_P) RPI-CM1.4(ETH_PAIR1_P) RPI-CM1.5(ETH_PAIR3_N) RPI-CM1.6(ETH_PAIR1_N) RPI-CM1.7(GND) RPI-CM1.8(GND) RPI-CM1.9(ETH_PAIR2_N) RPI-CM1.10(ETH_PAIR0_N) RPI-CM1.11(ETH_PAIR2_P) RPI-CM1.12(ETH_PAIR0_P) RPI-CM1.13(GND) RPI-CM1.14(GND) RPI-CM1.15(ETH_!LED3) RPI-CM1.16(FAN_TACHO) RPI-CM1.17(ETH_!LED2) RPI-CM1.18(ETH_SYNC_OUT) RPI-CM1.19(FAN_PWM) RPI-CM1.20(EEPROM_!WP) RPI-CM1.21(PI_!LED_ACTIVITY) RPI-CM1.22(GND) RPI-CM1.23(GND) RPI-CM1.24(GPIO26) RPI-CM1.25(GPIO21) RPI-CM1.26(GPIO19) RPI-CM1.27(GPIO20) RPI-CM1.28(GPIO13) RPI-CM1.29(GPIO16) RPI-CM1.30(GPIO6) RPI-CM1.31(GPIO12) RPI-CM1.32(GND) RPI-CM1.33(GND) RPI-CM1.34(GPIO5) RPI-CM1.35(ID_SC) RPI-CM1.36(ID_SD) RPI-CM1.37(GPIO7) RPI-CM1.38(GPIO11) RPI-CM1.39(GPIO8) RPI-CM1.40(GPIO9) RPI-CM1.41(GPIO25) RPI-CM1.42(GND) RPI-CM1.43(GND) RPI-CM1.44(GPIO10) RPI-CM1.45(GPIO24) RPI-CM1.46(GPIO22) RPI-CM1.47(GPIO23) RPI-CM1.48(GPIO27) RPI-CM1.49(GPIO18) RPI-CM1.50(GPIO17) RPI-CM1.51(GPIO15) RPI-CM1.52(GND) RPI-CM1.53(GND) RPI-CM1.54(GPIO4) RPI-CM1.55(GPIO14) RPI-CM1.56(GPIO3) RPI-CM1.57(SD_CLK) RPI-CM1.58(GPIO2) RPI-CM1.59(GND) RPI-CM1.60(GND) RPI-CM1.61(SD_DAT3) RPI-CM1.62(SD_CMD) RPI-CM1.63(SD_DAT0) RPI-CM1.64(SD_DAT5) RPI-CM1.65(GND) RPI-CM1.66(GND) RPI-CM1.67(SD_DAT1) RPI-CM1.68(SD_DAT4) RPI-CM1.69(SD_DAT2) RPI-CM1.70(SD_DAT7) RPI-CM1.71(GND) RPI-CM1.72(SD_DAT6) RPI-CM1.73(SD_VDD_OVERRIDE) RPI-CM1.74(GND) RPI-CM1.75(SD_PWR_ON) RPI-CM1.76(VBAT_RTC) RPI-CM1.77(+5V(INPUT)) RPI-CM1.78(GPIO_VREF) RPI-CM1.79(+5V(INPUT)) RPI-CM1.80(SCL0) RPI-CM1.81(+5V(INPUT)) RPI-CM1.82(SDA0) RPI-CM1.83(+5V(INPUT)) RPI-CM1.84(CM5_3.3V(OUTPUT)) RPI-CM1.85(+5V(INPUT)) RPI-CM1.86(CM5_3.3V(OUTPUT)) RPI-CM1.87(+5V(INPUT)) RPI-CM1.88(CM5_1.8V(OUTPUT)) RPI-CM1.89(WL_!DISABLE) RPI-CM1.90(CM5_1.8V(OUTPUT)) RPI-CM1.91(BT_!DISABLE) RPI-CM1.92(PWR_BUTTON) RPI-CM1.93(!RPIBOOT) RPI-CM1.94(USB_CC1) RPI-CM1.95(PI_LED_!PWR) RPI-CM1.96(USB_CC2) RPI-CM1.97(CAMERA_GPIO) RPI-CM1.98(GND) RPI-CM1.99(PMIC_ENABLE) RPI-CM1.100(CAM_GPIO1) RPI-CM1.101(USB_OTG_ID) RPI-CM1.102(PCIE_CLK_!REQ) RPI-CM1.103(USB_N) RPI-CM1.104(PCIE_DET_NWAKE) RPI-CM1.105(USB_P) RPI-CM1.106(PCIE_PWR_EN) RPI-CM1.107(GND) RPI-CM1.108(GND) RPI-CM1.109(PCIE_!RST) RPI-CM1.110(PCIE_CLK_P) RPI-CM1.111(VBUS_EN) RPI-CM1.112(PCIE_CLK_N) RPI-CM1.113(GND) RPI-CM1.114(GND) RPI-CM1.115(CAM1_D0_N) RPI-CM1.116(PCIE_RX_P) RPI-CM1.117(CAM1_D0_P) RPI-CM1.118(PCIE_RX_N) RPI-CM1.119(GND) RPI-CM1.120(GND) RPI-CM1.121(CAM1_D1_N) RPI-CM1.122(PCIE_TX_P) RPI-CM1.123(CAM1_D1_P) RPI-CM1.124(PCIE_TX_N) RPI-CM1.125(GND) RPI-CM1.126(GND) RPI-CM1.127(CAM1_C_N) RPI-CM1.128(USB3-0-RX_N) RPI-CM1.129(CAM1_C_P) RPI-CM1.130(USB3-0-RX_P) RPI-CM1.131(GND) RPI-CM1.132(GND) RPI-CM1.133(CAM1_D2_N) RPI-CM1.134(USB3-0-DP) RPI-CM1.135(CAM1_D2_P) RPI-CM1.136(USB3-0-DM) RPI-CM1.137(GND) RPI-CM1.138(GND) RPI-CM1.139(CAM1_D3_N) RPI-CM1.140(CAM0_C_N) RPI-CM1.141(CAM1_D3_P) RPI-CM1.142(CAM0_C_P) RPI-CM1.143(HDMI1_HOTPLUG) RPI-CM1.144(GND) RPI-CM1.145(HDMI1_SDA) RPI-CM1.146(HDMI1_TX2_P) RPI-CM1.147(HDMI1_SCL) RPI-CM1.148(HDMI1_TX2_N) RPI-CM1.149(HDMI1_CEC) RPI-CM1.150(GND) RPI-CM1.151(HDMI0_CEC) RPI-CM1.152(HDMI1_TX1_P) RPI-CM1.153(HDMI0_HOTPLUG) RPI-CM1.154(HDMI1_TX1_N) RPI-CM1.155(GND) RPI-CM1.156(GND) RPI-CM1.157(USB3-1-RX_N) RPI-CM1.158(HDMI1_TX0_P) RPI-CM1.159(USB3-1-RX_P) RPI-CM1.160(HDMI1_TX0_N) RPI-CM1.161(GND) RPI-CM1.162(GND) RPI-CM1.163(USB3-1-DP) RPI-CM1.164(HDMI1_CLK_P) RPI-CM1.165(USB3-1-DM) RPI-CM1.166(HDMI1_CLK_N) RPI-CM1.167(GND) RPI-CM1.168(GND) RPI-CM1.169(DSI0_C_N) RPI-CM1.170(HDMI0_TX2_P) RPI-CM1.171(DSI0_C_P) RPI-CM1.172(HDMI0_TX2_N) RPI-CM1.173(GND) RPI-CM1.174(GND) RPI-CM1.175(DSI1_D0_N) RPI-CM1.176(HDMI0_TX1_P) RPI-CM1.177(DSI1_D0_P) RPI-CM1.178(HDMI0_TX1_N) RPI-CM1.179(GND) RPI-CM1.180(GND) RPI-CM1.181(DSI1_D1_N) RPI-CM1.182(HDMI0_TX0_P) RPI-CM1.183(DSI1_D1_P) RPI-CM1.184(HDMI0_TX0_N) RPI-CM1.185(GND) RPI-CM1.186(GND) RPI-CM1.187(USB3-1-TX_N) RPI-CM1.188(HDMI0_CLK_P) RPI-CM1.189(USB3-1-TX_P) RPI-CM1.190(HDMI0_CLK_N) RPI-CM1.191(GND) RPI-CM1.192(GND) RPI-CM1.193(DSI1_D2_N) RPI-CM1.194(DSI1_D3_N) RPI-CM1.195(DSI1_D2_P) RPI-CM1.196(DSI1_D3_P) RPI-CM1.197(GND) RPI-CM1.198(GND) RPI-CM1.199(HDMI0_SDA) RPI-CM1.200(HDMI0_SCL)

### Notes on the sheet
- Ted Salmon

## Power pins joined to a net without a drawn wire
AVDD: U3.82(AVDD) U3.84(AVDD) U3.88(AVDD) U3.95(AVDD)
DVDD: U3.6(DVDD) U3.38(DVDD) U3.67(DVDD)
OVDD: U3.18(OVDD) U3.29(OVDD) U3.43(OVDD) U3.57(OVDD) U3.78(OVDD)
PVDD: U3.97(PVDD)

## Library data of the parts
C1 = Passives:100PF: 100pF Capacitor; DEVICE: 100PF-0603-100V-5%; MFG: KEMET; PN: C0603C101J1HACAUTO
C2 = Passives:1UF; DEVICE: 1uF-0805-50v-10%; MFG: TDK; PACKAGE: 0805; PN: CGA4J3X7R1H105K125AB
C3-C5 C7-C10 C37 C38 C51 C52 C57 C60 C62 = Passives:0.1UF: 0.1uF capacitor; DEVICE: 0.1UF-0603-5%-50V; MFG: KEMET; PN: C0603C104J5RACTU
C6 = Passives:RHS1V101MCN1GS; MFG: Nichicon; PN: RHS1V101MCN1GS
C36 C39 C41 C46 C50 C58 C59 C61 = Passives:10UF: 10uF Capacitor 1206 Package; DEVICE: 10UF-0603-16V-10%; MFG: Murata; PACKAGE: 0603; PN: GRT188R61C106KE13D
C42 C45 C47-C49 = Passives:1UF; DEVICE: 1uF-0603-16v-10%; MFG: TDK; PACKAGE: 0805; PN: CGA3E1X5R1C105K080AC
C43 C44 = Passives:220PF; DEVICE: 220pF-0603-50V-5%; MFG: Kemet; PN: C0603C221K5RACTU
C53 C54 = Passives:2.2UF: 2.2uF Capacitor; DEVICE: 2.2uF-0603-16V-10%; MFG: KEMET; PACKAGE: 0603; PN: C0603C225K4PAC
C55 C56 = Passives:10NF; DEVICE: 10NF-0603-5%-50V; MFG: KEMET; PN: C0603C103J5RACTU
D1 = Passives:SD103AWS-TP; MFG: MCC; PN: SD103AWS-TP
D3 = Passives:PMOSFET-SI2347DS; MFG: VISHAY; PN: Si2347DS-T1-GE3
D5 = Passives:SMBJ18A; MFG: Diodes; PN: SMBJ18A-13-F
F1 = Passives:LITTLEBLOCK_FUSE_3A: Littlefuse 154 Series Omni-BLOK Fuse; MFG: Littelfuse; PN: 0154003.DRT
FB1-FB3 = Passives:FERRITE_2A/120OHM; MFG: Bourns; PN: MH1608-121Y
FRAME1-FRAME8 = Frame:FRAME-LETTER: Schematic Frame - Letter Standard 8.5x11 US Letter frame
J1 = Connectors:3PIN_953442_1
J2 = Connectors:6PIN_953442_1: TE Conenctivity 953442-1 6-pin Header with Pinholes; MFG: TE; PN: 953442-1
J3 = Connectors:6PIN_5_103166_1; MFG: TE; PN: 5-103166-1
J5 = Connectors:SMB_CONN; MFG: Molex; PN: 73100-0259
L2 = Passives:ACM70V-701-2PL-TL00; MFG: TDK; PN: ACM70V-701-2PL-TL00
R1 = Passives:470OHM; DEVICE: 470OHM-0805-1/4-0.1%; MFG: Panasonic; PACKAGE: 0805; PN: ERJ-PB6B4700V
R2 = Passives:47KOHM: 47k Ohm Resistor; DEVICE: 47KOHM-0805-1/6-1%; MFG: Vishay; PACKAGE: 0805; PN: RCS080547K0FKEA
R3 R4 = Passives:25KOHM; DEVICE: 25KOHM-0805-1/8-1%; PACKAGE: 0805; PN: ERJ-6ENF8253V
R12 R20 R21 = Passives:10KOHM: 10K Ohm Resistor; DEVICE: 10KOHM-0603-1/4-1%; MFG: Panasonic; PACKAGE: 0603; PN: ERJ-PA3F1002V
R13-R19 = Passives:33OHM_ARR_4; DEVICE: 33OHM-4ARR-1%-62.5mw; MFG: Bourns; PN: CAY16-33R0F4LF
R22 = Passives:2.8KOHM: 2K Ohm Resistor; DEVICE: 2.8KOHM-0603-1/10-1%; MFG: Panasonic; PACKAGE: 0603; PN: ERJ-3EKF2801V
R29 = Passives:18KOHM; DEVICE: 18KOHM-0603-1/10-1%; MFG: Panasonic; PACKAGE: 0603; PN: ERJ-3RBD1802V
R30 R31 = Passives:150OHM; DEVICE: 150OHM-0603-1/4-1%; MFG: Panasonic; PACKAGE: 0603; PN: ERJ-PA3F1500V
R32 R33 = Passives:100OHM; DEVICE: 100OHM-0603-1/4-1%; MFG: Panasonic; PACKAGE: 0603; PN: ERJ-PA3F1000V
RPI-CM1 = ICs:RPI-CM5
SH1 = shorts:SHORT: Short between two nets; BOM: no
U1 = ICs:CD74HC4046A; MFG: Texas Instruments; PN: CD74HC4046APWR
U2 = ICs:THS8135
U3 = ICs:TFP401
U4 = ICs:SN65HVDA100; MFG: TI; MPN: SN65HVDA100-Q1
U5 = ICs:74LVC1G08; MFG: Nexperia; PN: 74LVC1G08GW,125
U6 = ICs:74VC1G86Q; MFG: Diodes Inc; PN: 74LVC1G86QSE-7
U7 = ICs:SN74AHC1G02; MFG: Texas Instruments; PN: SN74AHC1G02DCKR
U9 = ICs:DIT4096; MFG: Texas Instruments; PN: DIT4096IPW
U10 = ICs:PCM5122: The PCM512x devices are a family of monolithic CMOS-integrated circuits that include a stereo digitalto-analog converter.; MFG: Texas Instruments; PN: PCM5122PW
U11 = ICs:PAM8406; MFG: Diodes; PN: PAM8406DR
U12 = ICs:74HC4017PW; MFG: Nexperia; PN: 74HCT4017PW
U13 = ICs:MP2348; MFG: MPS; PN: MP2348
U14 = ICs:SN74HC163
U$2 = Connectors:HDMI_MOLEX_2086581051; MFG: MOLEX; PN: 2086581051

## Net classes
0 default: width 0.25 mm, drill 0.51 mm
2 3.3V: width 0.22 mm, drill 0.51 mm
3 VIN: width 0.3 mm, drill 0.51 mm
4 Data: width 0.25 mm, drill 0.51 mm
5 MCU_Data: width 0.22 mm, drill 0.51 mm
6 USB_5V: width 0.25 mm, drill 0.51 mm